# Altium schematic sheet Main.SchDoc
size B
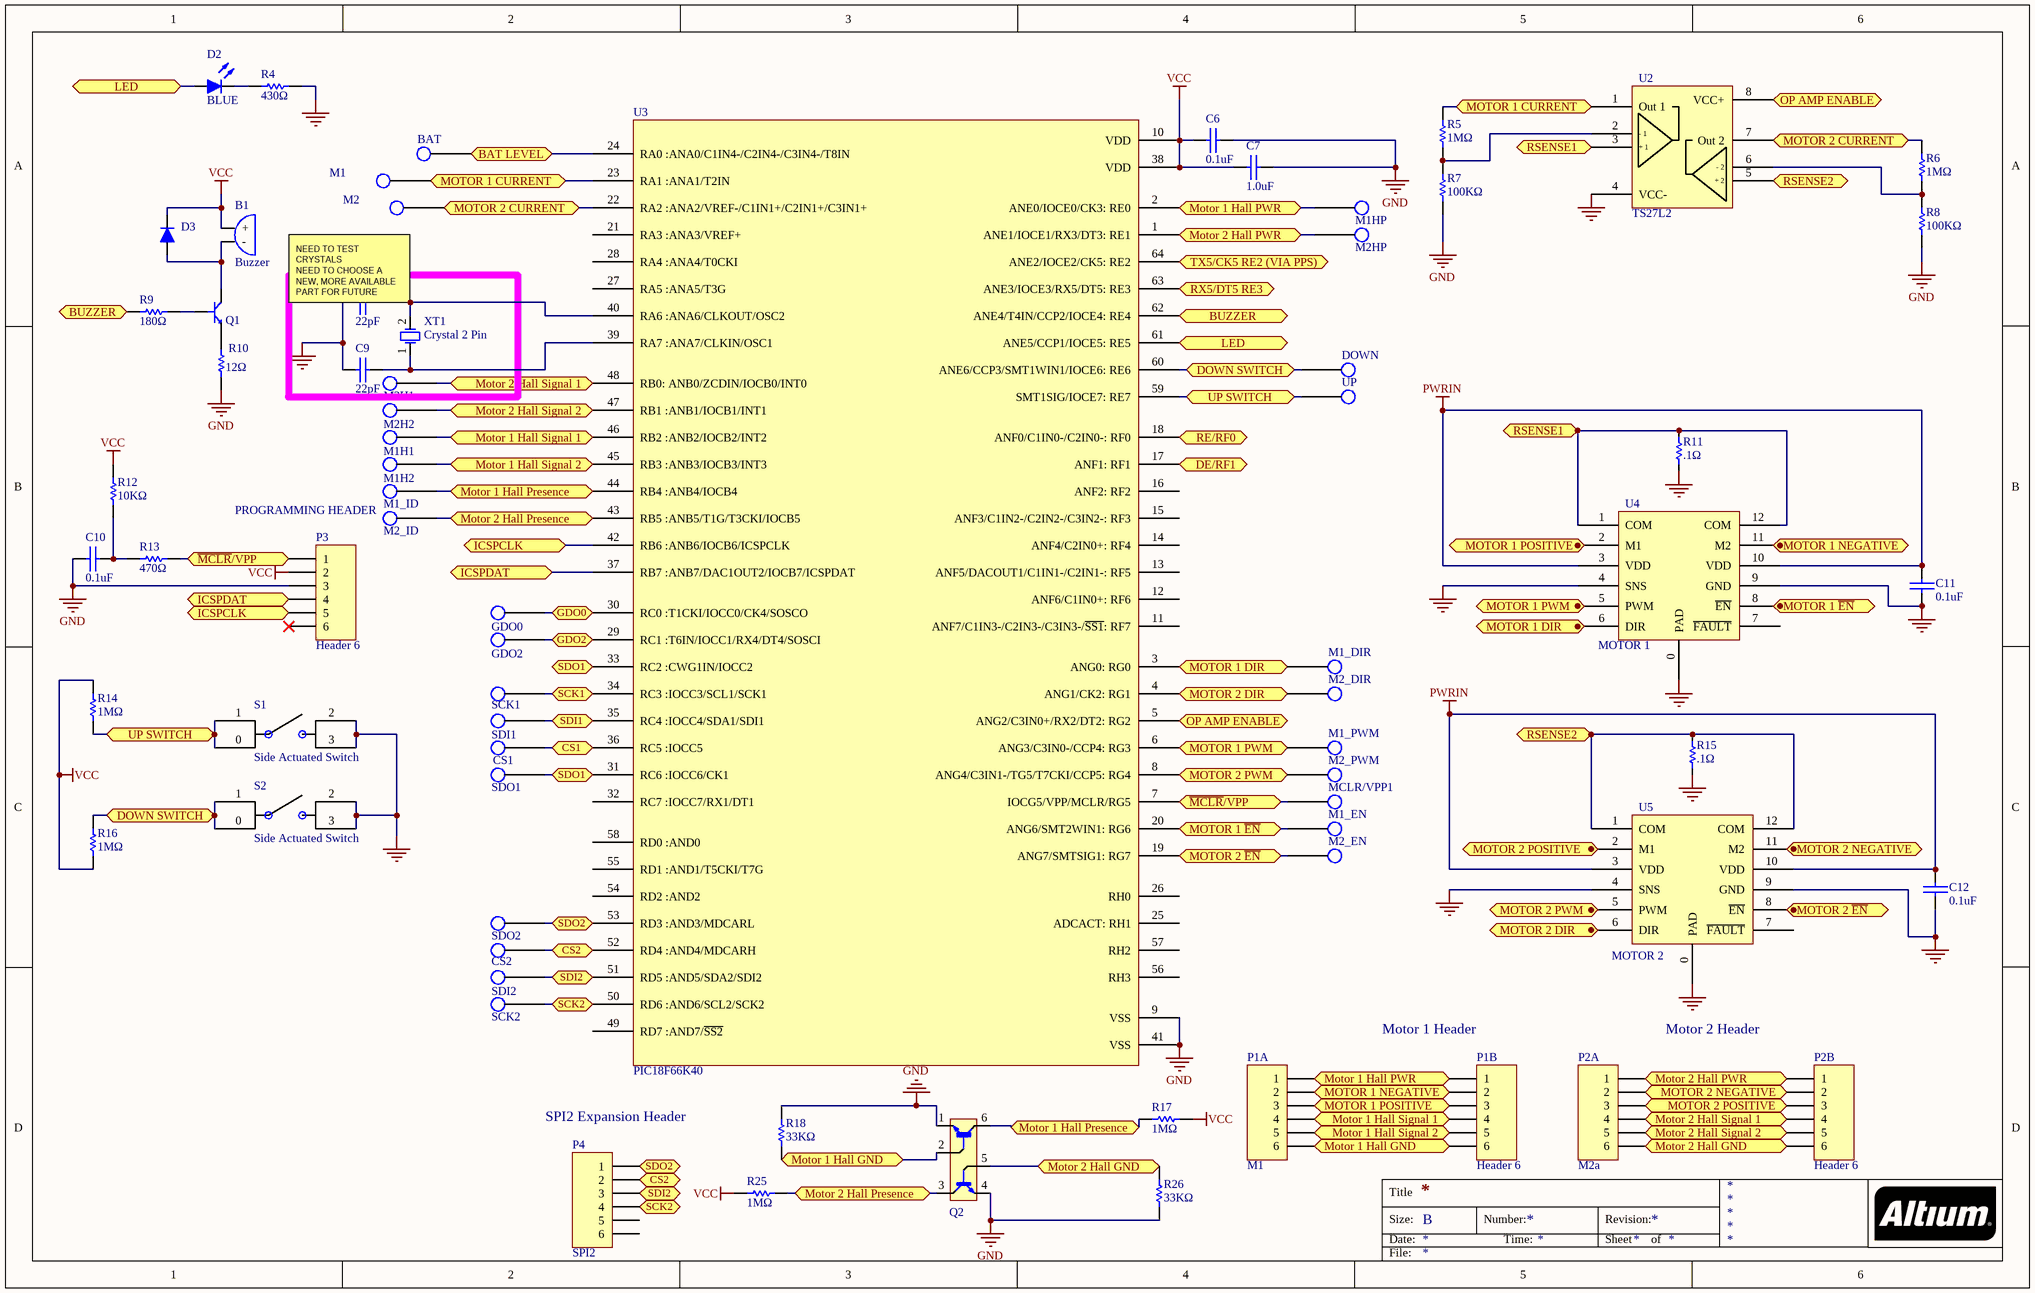
[diagram p0: Main.SchDoc]

## Parts
B1  Buzzer  [CST-931AP]  (no BOM)
BAT  (no value)  [TestPoint1]
C6  0.1uF  [0603 Small]
C7  1.0uF  [0603 Small]
C8  22pF  [0201]  (no BOM)
C9  22pF  [0201]  (no BOM)
C10  0.1uF  [0603 Small]
C11  0.1uF  [0603 Capacitor]
C12  0.1uF  [0603 Capacitor]
CS1  (no value)  [TestPoint1]
CS2  (no value)  [TestPoint1]
D2  BLUE  [0603 LED]
D3  (no value)  [SOD-323, SD-76]  (no BOM)
DOWN  (no value)  [TestPoint1]
GDO0  (no value)  [TestPoint1]
GDO2  (no value)  [TestPoint1]
M1  (no value)  [TestPoint1]
M1_DIR  (no value)  [TestPoint1]
M1_EN  (no value)  [TestPoint1]
M1_ID  (no value)  [TestPoint1]
M1_PWM  (no value)  [TestPoint1]
M1H1  (no value)  [TestPoint1]
M1H2  (no value)  [TestPoint1]
M1HP  (no value)  [TestPoint1]
M2  (no value)  [TestPoint1]
M2_DIR  (no value)  [TestPoint1]
M2_EN  (no value)  [TestPoint1]
M2_ID  (no value)  [TestPoint1]
M2_PWM  (no value)  [TestPoint1]
M2H1  (no value)  [TestPoint1]
M2H2  (no value)  [TestPoint1]
M2HP  (no value)  [TestPoint1]
MCLR/VPP1  (no value)  [TestPoint1]
P1A  M1  [2X3 Header (For track drapery)]
P1B  Header 6  [Track Edge Connector]
P2A  M2a  [2X3 Header (For track drapery)]
P2B  Header 6  [Track Edge Connector]
P3  Header 6  [Track Edge Connector]
P4  SPI2  [HDR2X2]
Q1  NPN  [SOT23 - duplicate]  (value not drawn)  (no BOM)
Q2  Dual BJT  [SOT-363]  (value not drawn)
R4  430Ω  [0603 Small]
R5  1MΩ  [0603 Resistor]
R6  1MΩ  [0603 Resistor]
R7  100KΩ  [0603 Resistor]
R8  100KΩ  [0603 Resistor]
R9  180Ω  [0402 Resistor]  (no BOM)
R10  12Ω  [6-0805_M]  (no BOM)
R11  .1Ω  [1206 Small]
R12  10KΩ  [0603 Small]
R13  470Ω  [0603 Small]
R14  1MΩ  [0603 Resistor]
R15  .1Ω  [1206 Small]
R16  1MΩ  [0603 Resistor]
R17  1MΩ  [0603 Resistor]
R18  33KΩ  [0603 Small]
R25  1MΩ  [0603 Resistor]
R26  33KΩ  [0603 Small]
S1  Side Actuated Switch  [HDP001L]
S2  Side Actuated Switch  [HDP001L]
SCK1  (no value)  [TestPoint1]
SCK2  (no value)  [TestPoint1]
SDI1  (no value)  [TestPoint1]
SDI2  (no value)  [TestPoint1]
SDO1  (no value)  [TestPoint1]
SDO2  (no value)  [TestPoint1]
U2  TS27L2  [SOIC-8]
U3  PIC18F66K40  [64TQFP]
U4  MOTOR 1  [TD1233]
U5  MOTOR 2  [TD1233]
UP  (no value)  [TestPoint1]
XT1  Crystal 2 Pin  [HC-49S]  (no BOM)

## Ports
BAT LEVEL (bidir), BUZZER (bidir), CS1 (bidir), CS2 (bidir), DE/RF1, DOWN SWITCH (bidir), GDO0 (bidir), GDO2 (bidir), ICSPCLK, ICSPDAT, LED (bidir), MOTOR 1 CURRENT, MOTOR 1 DIR, Motor 1 Hall GND, Motor 1 Hall Presence, Motor 1 Hall PWR, Motor 1 Hall Signal 1, Motor 1 Hall Signal 2, MOTOR 1 NEGATIVE, MOTOR 1 POSITIVE, MOTOR 1 PWM, MOTOR 1 ~{EN}, MOTOR 2 CURRENT, MOTOR 2 DIR, Motor 2 Hall GND, Motor 2 Hall Presence, Motor 2 Hall PWR, Motor 2 Hall Signal 1, Motor 2 Hall Signal 2, MOTOR 2 NEGATIVE, MOTOR 2 POSITIVE, MOTOR 2 PWM, MOTOR 2 ~{EN}, OP AMP ENABLE (bidir), RE/RF0, RSENSE1, RSENSE2, RX5/DT5 RE3, SCK1 (bidir), SCK2 (bidir), SDI1 (bidir), SDI2 (bidir), SDO1 (bidir), SDO2 (bidir), TX5/CK5 RE2 (VIA PPS), UP SWITCH (bidir), ~{MCLR}/VPP

## Nets
GND: C6.1 C7.1 C8.1 C9.1 C10.1 C11.1 C12.1 P3.3 Q2.1 Q2.4 R4.2 R7.2 R8.2 R10.1 R11.2 R15.2 R18.1 R26.2 S1.2 S1.3 S2.2 S2.3 U2.4(VCC-) U3.9(VSS) U3.41(VSS) U4.0(PAD) U4.4(SNS) U4.9(GND) U5.0(PAD) U5.4(SNS) U5.9(GND)
PWRIN: C11.2 C12.2 U4.3(VDD) U4.10(VDD) U5.3(VDD) U5.10(VDD)
VCC: B1.1(+) C6.2 C7.2 D3.2 P3.2 R12.2 R14.2 R16.1 R17.2 R25.1 U3.10(VDD) U3.38(VDD)
BAT LEVEL: BAT.0 U3.24(RA0_:ANA0/C1IN4-/C2IN4-/C3IN4-/T8IN) ; port BAT LEVEL
BUZZER: R9.1 U3.62(ANE4/T4IN/CCP2/IOCE4:_RE4) ; port BUZZER
CS1: CS1.0 U3.36(RC5_:IOCC5) ; port CS1
CS2: CS2.0 P4.2 U3.52(RD4_:AND4/MDCARH) ; port CS2
DE/RF1: U3.17(ANF1:_RF1) ; port DE/RF1
DOWN SWITCH: DOWN.0 R16.2 S2.0 S2.1 U3.60(ANE6/CCP3/SMT1WIN1/IOCE6:_RE6) ; port DOWN SWITCH
GDO0: GDO0.0 U3.30(RC0_:T1CKI/IOCC0/CK4/SOSCO) ; port GDO0
GDO2: GDO2.0 U3.29(RC1_:T6IN/IOCC1/RX4/DT4/SOSCI) ; port GDO2
ICSPCLK: P3.5 U3.42(RB6_:ANB6/IOCB6/ICSPCLK) ; port ICSPCLK
ICSPDAT: P3.4 U3.37(RB7_:ANB7/DAC1OUT2/IOCB7/ICSPDAT) ; port ICSPDAT
LED: D2.1(A) U3.61(ANE5/CCP1/IOCE5:_RE5) ; port LED
~{MCLR}/VPP: MCLR/VPP1.0 P3.1 R13.1 U3.7(IOCG5/VPP/MCLR/RG5) ; port ~{MCLR}/VPP
MOTOR 1 CURRENT: M1.0 R5.1 U2.1(Out_1) U3.23(RA1_:ANA1/T2IN) ; port MOTOR 1 CURRENT
MOTOR 1 DIR: M1_DIR.0 U3.3(ANG0:_RG0) ; port MOTOR 1 DIR
MOTOR 1 ~{EN}: M1_EN.0 U3.20(ANG6/SMT2WIN1:_RG6) ; port MOTOR 1 ~{EN}
Motor 1 Hall GND: P1A.6 P1B.6 Q2.2 R18.2 ; port Motor 1 Hall GND
Motor 1 Hall Presence: M1_ID.0 Q2.6 R17.1 U3.44(RB4_:ANB4/IOCB4) ; port Motor 1 Hall Presence
Motor 1 Hall PWR: M1HP.0 P1A.1 P1B.1 U3.2(ANE0/IOCE0/CK3:_RE0) ; port Motor 1 Hall PWR
Motor 1 Hall Signal 1: M1H1.0 P1A.4 P1B.4 U3.46(RB2_:ANB2/IOCB2/INT2) ; port Motor 1 Hall Signal 1
Motor 1 Hall Signal 2: M1H2.0 P1A.5 P1B.5 U3.45(RB3_:ANB3/IOCB3/INT3) ; port Motor 1 Hall Signal 2
MOTOR 1 NEGATIVE: P1A.2 P1B.2 ; port MOTOR 1 NEGATIVE
MOTOR 1 POSITIVE: P1A.3 P1B.3 ; port MOTOR 1 POSITIVE
MOTOR 1 PWM: M1_PWM.0 U3.6(ANG3/C3IN0-/CCP4:_RG3) ; port MOTOR 1 PWM
MOTOR 2 CURRENT: M2.0 R6.1 U2.7(Out_2) U3.22(RA2_:ANA2/VREF-/C1IN1+/C2IN1+/C3IN1+) ; port MOTOR 2 CURRENT
MOTOR 2 DIR: M2_DIR.0 U3.4(ANG1/CK2:_RG1) ; port MOTOR 2 DIR
MOTOR 2 ~{EN}: M2_EN.0 U3.19(ANG7/SMTSIG1:_RG7) ; port MOTOR 2 ~{EN}
Motor 2 Hall GND: P2A.6 P2B.6 Q2.5 R26.1 ; port Motor 2 Hall GND
Motor 2 Hall Presence: M2_ID.0 Q2.3 R25.2 U3.43(RB5_:ANB5/T1G/T3CKI/IOCB5) ; port Motor 2 Hall Presence
Motor 2 Hall PWR: M2HP.0 P2A.1 P2B.1 U3.1(ANE1/IOCE1/RX3/DT3:_RE1) ; port Motor 2 Hall PWR
Motor 2 Hall Signal 1: M2H1.0 P2A.4 P2B.4 U3.48(RB0:_ANB0/ZCDIN/IOCB0/INT0) ; port Motor 2 Hall Signal 1
Motor 2 Hall Signal 2: M2H2.0 P2A.5 P2B.5 U3.47(RB1_:ANB1/IOCB1/INT1) ; port Motor 2 Hall Signal 2
MOTOR 2 NEGATIVE: P2A.2 P2B.2 ; port MOTOR 2 NEGATIVE
MOTOR 2 POSITIVE: P2A.3 P2B.3 ; port MOTOR 2 POSITIVE
MOTOR 2 PWM: M2_PWM.0 U3.8(ANG4/C3IN1-/TG5/T7CKI/CCP5:_RG4) ; port MOTOR 2 PWM
OP AMP ENABLE: U2.8(VCC+) U3.5(ANG2/C3IN0+/RX2/DT2:_RG2) ; port OP AMP ENABLE
RE/RF0: U3.18(ANF0/C1IN0-/C2IN0-:_RF0) ; port RE/RF0
RSENSE1: R11.1 U2.3(+_1) U4.1(COM) U4.12(COM) ; port RSENSE1
RSENSE2: R15.1 U2.5(+_2) U5.1(COM) U5.12(COM) ; port RSENSE2
RX5/DT5 RE3: U3.63(ANE3/IOCE3/RX5/DT5:_RE3) ; port RX5/DT5 RE3
SCK1: SCK1.0 U3.34(RC3_:IOCC3/SCL1/SCK1) ; port SCK1
SCK2: P4.4 SCK2.0 U3.50(RD6_:AND6/SCL2/SCK2) ; port SCK2
SDI1: SDI1.0 U3.35(RC4_:IOCC4/SDA1/SDI1) ; port SDI1
SDI2: P4.3 SDI2.0 U3.51(RD5_:AND5/SDA2/SDI2) ; port SDI2
SDO1: SDO1.0 U3.31(RC6_:IOCC6/CK1) U3.33(RC2_:CWG1IN/IOCC2) ; port SDO1
SDO2: P4.1 SDO2.0 U3.53(RD3_:AND3/MDCARL) ; port SDO2
TX5/CK5 RE2 (VIA PPS): U3.64(ANE2/IOCE2/CK5:_RE2) ; port TX5/CK5 RE2 (VIA PPS)
UP SWITCH: R14.1 S1.0 S1.1 U3.59(SMT1SIG/IOCE7:_RE7) UP.0 ; port UP SWITCH
NetB1_2: B1.2(-) D3.1 Q1.1
NetC8_2: C8.2 U3.40(RA6_:ANA6/CLKOUT/OSC2) XT1.2
NetC9_2: C9.2 U3.39(RA7_:ANA7/CLKIN/OSC1) XT1.1
NetC10_2: C10.2 R12.1 R13.2
NetD2_2: D2.2(K) R4.1
NetQ1_2: Q1.2 R10.2
NetQ1_3: Q1.3 R9.2
NetR5_2: R5.2 R7.1 U2.2(-_1)
NetR6_2: R6.2 R8.1 U2.6(-_2)

Not connected (* = marked no-connect by the designer): P3 6*; P4 5 6; U3 11(ANF7/C1IN3-/C2IN3-/C3IN3-/~{SS1}:_RF7) 12(ANF6/C1IN0+:_RF6) 13(ANF5/DACOUT1/C1IN1-/C2IN1-:_RF5) 14(ANF4/C2IN0+:_RF4) 15(ANF3/C1IN2-/C2IN2-/C3IN2-:_RF3) 16(ANF2:_RF2) 21(RA3_:ANA3/VREF+) 25(ADCACT:_RH1) 26(RH0) 27(RA5_:ANA5/T3G) 28(RA4_:ANA4/T0CKI) 32(RC7_:IOCC7/RX1/DT1) 49(RD7_:AND7/~{SS2}) 54(RD2_:AND2) 55(RD1_:AND1/T5CKI/T7G) 56(RH3) 57(RH2) 58(RD0_:AND0); U4 2(M1) 5(PWM) 6(DIR) 7(~{FAULT}) 8(~{EN}) 11(M2); U5 2(M1) 5(PWM) 6(DIR) 7(~{FAULT}) 8(~{EN}) 11(M2)

## Notes on the sheet
- (near C8) NEED TO TEST CRYSTALS
  NEED TO CHOOSE A NEW, MORE AVAILABLE PART FOR FUTURE ORDERS
- PROGRAMMING HEADER
- (near P1B) Motor 1 Header
- Motor 2 Header
- SPI2 Expansion Header
- Title
- Size:
- Date:
- B
- Number:
- Time:
- Revision:
- Sheet
- of
- File:

## Library data of the parts
B1 = Buzzer: AUDIO MAGNETIC XDCR 2-4V TH; Manufacturer: CUI Inc.; Cost: 0.62; Manufacturer#: CST-931AP
BAT CS1 CS2 DOWN GDO0 GDO2 M1 M1_DIR M1_EN M1_ID M1_PWM M1H1 M1H2 M1HP M2 M2_DIR M2_EN M2_ID M2_PWM M2H1 M2H2 M2HP MCLR/VPP1 SCK1 SCK2 SDI1 SDI2 SDO1 SDO2 UP = TEST POINT
C6 C10 = CAP: CAP CER 0.1UF 50V 10% X7R 0603; Manufacturer: Murata Electronics; Manufacturer#: GRM188R71H104KA93J; Cost: 0.022
C7 = CAP: CAP CER 1UF 50V 10% X5R 0603; Manufacturer: TAIYO YUDEN; Manufacturer#: UMK107BJ105KA-T; Cost: 0.0303
C8 C9 = CAP: CAP CER 22PF 50V NP0 0201; Manufacturer: Murata Electronics; Manufacturer#: GRM0335C1H220JA01D; Cost: .00182
C11 C12 = CAP: MLCC - SMD/SMT 0603 0.1uF 50volts X7R 10%; Manufacturer: Murata Electronics; Manufacturer#: GCM188R71H104KA57D; Cost: 0.018
D2 = LED2: LED BLUE DIFFUSED 0603 SMD; Manufacturer: OSRAM Opto Semiconductors Inc.; Manufacturer#: LB Q39G-L2OO-35-1; Cost: 0.08349
D3 = Diode: Diode Small Signal Switching 100V 0.25A 2-Pin SOD-323 T/R; Manufacturer: Vishay Semiconductors; Manufacturer#: BAS16WS-E3-08; Cost: 0.03
P1A P1B P2A P2B P3 P4 = Header 6: Header, 6-Pin
  P1A P2A: LatestRevisionDate: 17-Jul-2002; LatestRevisionNote: Re-released for DXP Platform.; Publisher: Altium Limited
Q1 = NPN: Trans GP BJT NPN 40V 0.6A 3-Pin SOT-23 T/R; Manufacturer: MCC; Manufacturer#: 833MMBT2222A-TP; Cost: 0.028
Q2 = Dual BJT: BJT COMPOSITE TRANSISTOR GL WNG 2.9x2.8mm; Manufacturer: ON Semiconductor; Manufacturer#: MBT2222ADW1T1G; Cost: 0.05146
R4 = Res1: Thick Film Resistors - SMD 1/10watt 430ohms 1%; Manufacturer: Vishay Semiconductors; Manufacturer#: CRCW0603430RFKEA; Cost: 0.018
R5 R6 R14 R16 R17 R25 = Res1: RES SMD 1M OHM 5% 1/10W 0603; Manufacturer: Yageo; Manufacturer#: RC0603JR-071ML; Cost: .00198
R7 R8 = Res1: RES SMD 100K OHM 5% 1/10W 0603; Manufacturer: Yageo; Manufacturer#: RC0603JR-07100KL; Cost: 0.00198
R9 = Res1: RES SMD 180 OHM 1% 1/10W 0402; Manufacturer: Panasonic; Manufacturer#: ERJ-2RKF1800X; Cost: 0.005
R10 = Res1: RES SMD 12 OHM 5% 1/2W 0805; Manufacturer: Panasonic Electronic Components; Manufacturer#: ERJ-P06J120V; Cost: .06318
R11 R15 = Resistor: RES SMD 0.1 OHM 1% 1W 1206; Manufacturer: Samsung Electro-Mechanics America, Inc.; Manufacturer#: RUW3216FR100CS; Cost: .05544
R12 R13 = Res1: Thick Film Resistors - SMD 0603 10Kohms 1% Tol; Manufacturer: Panasonic; Manufacturer#: ERJ-3EKF1002V; Cost: 0.002
R18 R26 = Res1: Thick Film Resistors - SMD 0603 10Kohms 1% Tol; Manufacturer: Yageo; Manufacturer#: RC0402FR-0733KL; Cost: 0.00242
S1 S2 = Side Actuated Switch: SWITCH DETECTOR SPST-NO 1MA 5V; Manufacturer: C&K Components; Manufacturer#: HDP001L; Cost: 0.26257
U2 = TS27L2: OP AMP - 2 CHANNEL; Manufacturer: STMicroelectronics; Manufacturer#: TS27L2CDT; Cost: .1842
U3 = PIC18F66K40: IC MCU 8BIT 64KB FLASH 64TQFP; Manufacturer: Microchip Technology; Manufacturer#: PIC18F66K40T-I/PT; Cost: 1.9158
U4 U5 = MAX14870: IC MOTOR DVR DC FULL BR 12TDFN; Manufacturer: Maxim Integrated; Manufacturer#: MAX14870ETC+T; Cost: 1.6157
XT1 = Crystal 2 Pin: Design Item Id: CRYS-25MHz-QC49